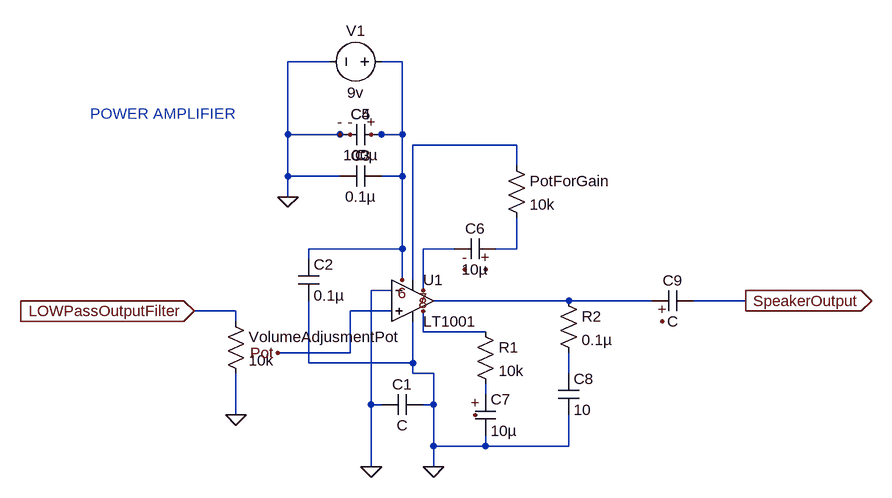
[diagram p0: schematic Draft3.asc]
Draft3.asc, the LTspice schematic file:
Version 4
SHEET 1 1144 680
WIRE 272 -288 208 -288
WIRE 384 -288 352 -288
WIRE 208 -176 208 -288
WIRE 288 -176 208 -176
WIRE 384 -176 384 -288
WIRE 384 -176 352 -176
WIRE 560 -160 400 -160
WIRE 560 -128 560 -160
WIRE 208 -112 208 -176
WIRE 288 -112 208 -112
WIRE 384 -112 384 -176
WIRE 384 -112 352 -112
WIRE 208 -80 208 -112
WIRE 384 0 384 -112
WIRE 384 0 240 0
WIRE 464 0 416 0
WIRE 560 0 560 -48
WIRE 560 0 528 0
WIRE 240 16 240 0
WIRE 384 48 384 0
WIRE 400 48 400 -160
WIRE 368 64 336 64
WIRE 416 64 416 0
WIRE 640 80 432 80
WIRE 768 80 640 80
WIRE 912 80 832 80
WIRE 128 96 64 96
WIRE 368 96 304 96
WIRE 128 112 128 96
WIRE 416 128 416 96
WIRE 512 128 416 128
WIRE 304 160 304 96
WIRE 304 160 192 160
WIRE 240 176 240 80
WIRE 400 176 400 112
WIRE 400 176 240 176
WIRE 400 192 400 176
WIRE 432 192 400 192
WIRE 640 192 640 160
WIRE 512 224 512 208
WIRE 336 240 336 64
WIRE 352 240 336 240
WIRE 432 240 432 192
WIRE 432 240 416 240
WIRE 128 256 128 192
WIRE 432 304 432 240
WIRE 512 304 512 288
WIRE 512 304 432 304
WIRE 640 304 640 256
WIRE 640 304 512 304
WIRE 336 336 336 240
WIRE 432 336 432 304
FLAG 64 96 LOWPassOutputFilter
IOPIN 64 96 In
FLAG 192 160 Pot
FLAG 128 256 0
FLAG 384 48 6
FLAG 416 64 8
FLAG 416 96 7
FLAG 336 336 0
FLAG 432 336 0
FLAG 208 -80 0
FLAG 336 -176 +
FLAG 288 -176 -
FLAG 304 -176 -
FLAG 512 32 +
FLAG 480 32 -
FLAG 496 256 +
FLAG 912 80 SpeakerOutput
IOPIN 912 80 Out
FLAG 784 112 +
SYMBOL res 112 96 R0
SYMATTR InstName VolumeAdjusmentPot
SYMATTR Value 10k
SYMBOL Opamps\\LT1001 400 16 R0
SYMATTR InstName U1
SYMBOL cap 416 224 R90
WINDOW 0 0 32 VBottom 2
WINDOW 3 32 32 VTop 2
SYMATTR InstName C1
SYMBOL cap 224 16 R0
SYMATTR InstName C2
SYMATTR Value 0.1µ
SYMBOL cap 352 -128 R90
WINDOW 0 0 32 VBottom 2
WINDOW 3 32 32 VTop 2
SYMATTR InstName C3
SYMATTR Value 0.1µ
SYMBOL cap 352 -192 R90
WINDOW 0 0 32 VBottom 2
WINDOW 3 32 32 VTop 2
SYMATTR InstName C4
SYMATTR Value 100µ
SYMBOL cap 352 -192 R90
WINDOW 0 0 32 VBottom 2
WINDOW 3 32 32 VTop 2
SYMATTR InstName C5
SYMBOL voltage 368 -288 R90
WINDOW 0 -32 56 VBottom 2
WINDOW 3 32 56 VTop 2
WINDOW 123 0 0 Left 0
WINDOW 39 0 0 Left 0
SYMATTR InstName V1
SYMATTR Value 9v
SYMBOL cap 528 -16 R90
WINDOW 0 0 32 VBottom 2
WINDOW 3 32 32 VTop 2
SYMATTR InstName C6
SYMATTR Value 10µ
SYMBOL res 544 -144 R0
SYMATTR InstName PotForGain
SYMATTR Value 10k
SYMBOL res 496 112 R0
SYMATTR InstName R1
SYMATTR Value 10k
SYMBOL cap 496 224 R0
SYMATTR InstName C7
SYMATTR Value 10µ
SYMBOL res 624 64 R0
SYMATTR InstName R2
SYMATTR Value 0.1µ
SYMBOL cap 624 192 R0
SYMATTR InstName C8
SYMATTR Value 10
SYMBOL cap 832 64 R90
WINDOW 0 0 32 VBottom 2
WINDOW 3 32 32 VTop 2
SYMATTR InstName C9
TEXT -96 -208 Left 2 ;POWER AMPLIFIER

The netlist it stands for:
* Draft3.asc
R§VolumeAdjusmentPot LOWPassOutputFilter 0 10k
XU1 Pot 0 N001 0 N003 LT1001  ; pins In+ In- V+ V- OUT
C1 0 0 C
C2 6 0 0.1µ
C3 6 0 0.1µ
C4 6 0 100µ
C5 6 0 C
V1 6 0 9v
C6 N002 8 10µ
R§PotForGain N001 N002 10k
R1 7 N005 10k
C7 N005 0 10µ
R2 N003 N004 0.1µ
C8 N004 0 10
C9 SpeakerOutput N003 C
* POWER AMPLIFIER
.lib LTC.lib
.backanno
.end